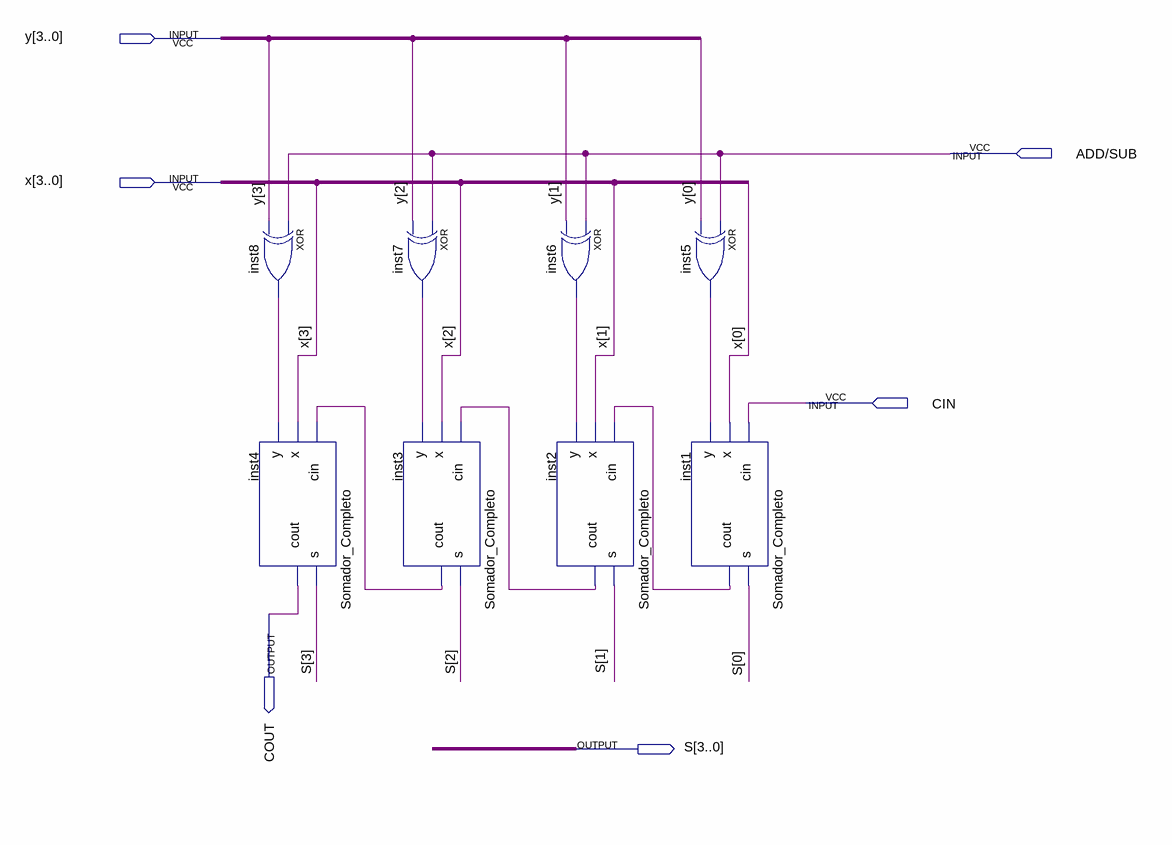
[diagram p0: schematic sheet]
// Quartus schematic AddSub.bdf as structural Verilog: 8 symbols, 6 pins
module AddSub (
  input  [3:0] y,
  input  \ADD/SUB ,
  input  [3:0] x,
  input  CIN,
  output COUT,
  output [3:0] S
);

  wire inst1_cout, inst2_cout, inst3_cout, inst5_out, inst6_out, inst7_out, inst8_out;

  xor inst8 (inst8_out, \ADD/SUB , y[3]);
  Somador_Completo inst4 (.cin(inst3_cout), .x(x[3]), .y(inst8_out), .s(S[3]), .cout(COUT));
  xor inst7 (inst7_out, \ADD/SUB , y[2]);
  Somador_Completo inst3 (.cin(inst2_cout), .x(x[2]), .y(inst7_out), .s(S[2]), .cout(inst3_cout));
  xor inst6 (inst6_out, \ADD/SUB , y[1]);
  Somador_Completo inst2 (.cin(inst1_cout), .x(x[1]), .y(inst6_out), .s(S[1]), .cout(inst2_cout));
  xor inst5 (inst5_out, \ADD/SUB , y[0]);
  Somador_Completo inst1 (.cin(CIN), .x(x[0]), .y(inst5_out), .s(S[0]), .cout(inst1_cout));
endmodule
